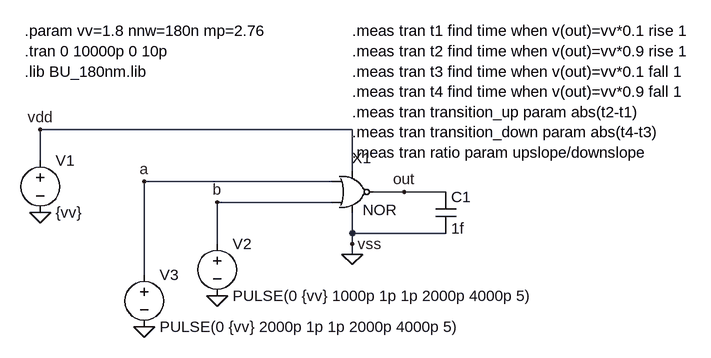
[diagram p0: schematic nor_test.asc]
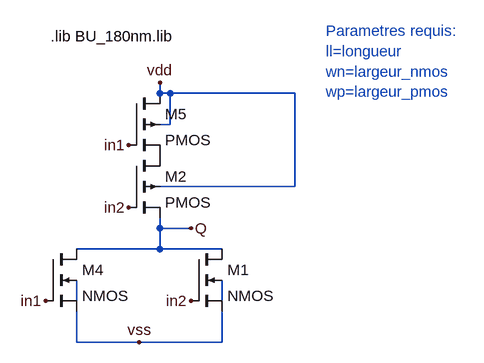
[diagram p1: sub-circuit nor.asc]
nor_test.asc, the LTspice schematic file:
Version 4
SHEET 1 1168 680
WIRE 416 224 -64 224
WIRE -64 272 -64 224
WIRE 416 288 416 224
WIRE 384 304 96 304
WIRE 496 320 448 320
WIRE 560 320 496 320
WIRE 384 336 208 336
WIRE 416 384 416 352
WIRE 560 384 416 384
WIRE 208 400 208 336
WIRE 416 400 416 384
WIRE 416 416 416 400
WIRE 96 448 96 304
FLAG -64 352 0
FLAG 208 480 0
FLAG 416 416 0
FLAG -64 224 vdd
FLAG 416 400 vss
FLAG 208 336 b
FLAG 496 320 out
FLAG 96 528 0
FLAG 96 304 a
SYMBOL /voltage -64 256 R0
SYMATTR InstName V1
SYMATTR Value {vv}
SYMBOL /voltage 208 384 R0
SYMATTR InstName V2
SYMATTR Value PULSE(0 {vv} 1000p 1p 1p 2000p 4000p 5)
SYMBOL /voltage 96 432 R0
SYMATTR InstName V3
SYMATTR Value PULSE(0 {vv} 2000p 1p 1p 2000p 4000p 5)
SYMBOL nor 416 320 R0
SYMATTR InstName X1
SYMATTR SpiceLine ll=180n wn={nnw} wp={nnw*mp}
SYMBOL cap 544 320 R0
SYMATTR InstName C1
SYMATTR Value 1f
TEXT -88 72 Left 2 !.param vv=1.8 nnw=180n mp=2.76\n.tran 0 10000p 0 10p\n.lib BU_180nm.lib
TEXT 416 72 Left 2 !.meas tran t1 find time when v(out)=vv*0.1 rise 1\n.meas tran t2 find time when v(out)=vv*0.9 rise 1\n.meas tran t3 find time when v(out)=vv*0.1 fall 1\n.meas tran t4 find time when v(out)=vv*0.9 fall 1\n.meas tran transition_up param abs(t2-t1)\n.meas tran transition_down param abs(t4-t3)\n.meas tran ratio param upslope/downslope

nor.asc, the sub-circuit schematic file:
Version 4
SHEET 1 1252 1108
WIRE 320 288 320 272
WIRE 336 288 320 288
WIRE 528 288 336 288
WIRE 336 336 336 288
WIRE 336 336 320 336
WIRE 528 432 528 288
WIRE 528 432 320 432
WIRE 320 496 320 480
WIRE 368 496 320 496
WIRE 320 528 320 496
WIRE 320 528 192 528
WIRE 416 528 320 528
WIRE 192 608 192 576
WIRE 416 608 416 576
WIRE 192 672 192 624
WIRE 288 672 192 672
WIRE 416 672 416 624
WIRE 416 672 288 672
FLAG 320 272 vdd
FLAG 288 672 vss
FLAG 144 608 in1
FLAG 368 608 in2
FLAG 272 464 in2
FLAG 272 368 in1
FLAG 368 496 Q
SYMBOL nmos4 368 528 R0
SYMATTR InstName M1
SYMATTR Value2 l={ll} w={wn} ad={450n*{wn}} as={450n*{wn}} pd={900n+{wn}} ps={1080n+{wn}}
SYMBOL nmos4 144 528 R0
SYMATTR InstName M4
SYMATTR Value2 l={ll} w={2*wn} ad={450n*{wn}} as={450n*{wn}} pd={900n+{wn}} ps={1080n+{wn}}
SYMBOL pmos4 272 288 R0
SYMATTR InstName M5
SYMATTR Value2 l={ll} w={2*wp} ad={450n*{wp}} as={450n*{wp}} pd={900n+{wp}} ps={1080n+{wp}}
SYMBOL pmos4 272 384 R0
SYMATTR InstName M2
SYMATTR Value2 l={ll} w={2*wp} ad={450n*{wp}} as={450n*{wp}} pd={900n+{wp}} ps={1080n+{wp}}
TEXT 152 200 Left 2 !.lib BU_180nm.lib
TEXT 576 192 Left 2 ;Parametres requis: \nll=longueur \nwn=largeur_nmos \nwp=largeur_pmos

The netlist it stands for:
* nor_test.asc
V1 vdd 0 {vv}
V2 b 0 PULSE(0 {vv} 1000p 1p 1p 2000p 4000p 5)
V3 a 0 PULSE(0 {vv} 2000p 1p 1p 2000p 4000p 5)
XX1 a out vdd 0 b nor params: NOR ll=180n wn={nnw} wp={nnw*mp}
C1 out 0 1f

* block symbol definitions
.subckt nor in1 Q vdd vss in2
M1 Q in2 vss N002 NMOS l={ll} w={wn} ad={450n*{wn}} as={450n*{wn}} pd={900n+{wn}} ps={1080n+{wn}}
M4 Q in1 vss N001 NMOS l={ll} w={2*wn} ad={450n*{wn}} as={450n*{wn}} pd={900n+{wn}} ps={1080n+{wn}}
M5 vdd in1 P001 vdd PMOS l={ll} w={2*wp} ad={450n*{wp}} as={450n*{wp}} pd={900n+{wp}} ps={1080n+{wp}}
M2 P001 in2 Q vdd PMOS l={ll} w={2*wp} ad={450n*{wp}} as={450n*{wp}} pd={900n+{wp}} ps={1080n+{wp}}
.lib BU_180nm.lib
* Parametres requis:
* ll=longueur
* wn=largeur_nmos
* wp=largeur_pmos
.ends nor

.model NMOS NMOS
.model PMOS PMOS
.lib standard.mos
.param vv=1.8 nnw=180n mp=2.76
.tran 0 10000p 0 10p
.lib BU_180nm.lib
.meas tran t1 find time when v(out)=vv*0.1 rise 1
.meas tran t2 find time when v(out)=vv*0.9 rise 1
.meas tran t3 find time when v(out)=vv*0.1 fall 1
.meas tran t4 find time when v(out)=vv*0.9 fall 1
.meas tran transition_up param abs(t2-t1)
.meas tran transition_down param abs(t4-t3)
.meas tran ratio param upslope/downslope
.backanno
.end

* Results of the author's LTspice run, read from the files saved beside the schematic
* Operating Point, zero values left out:
*   V(vdd) = 1.8 V
*   V(out) = 1.8 V
*   I(V1) = -2.39 nA
*   Ix(x1:VDD) = 2.39 nA
*   Ix(x1:VSS) = -2.39 nA
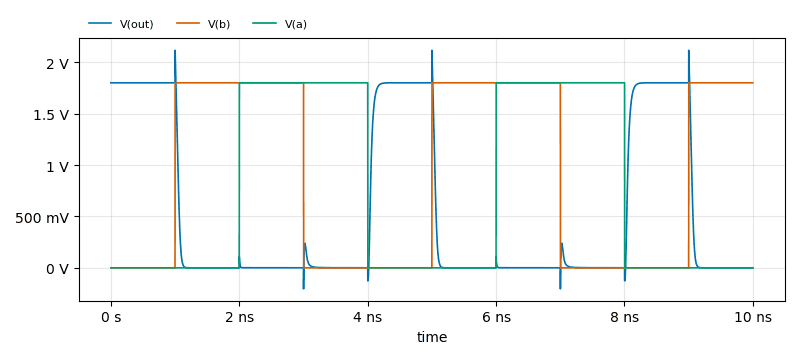
[diagram p2: Transient Analysis of nor_test.asc, plotted from the saved traces]
* Transient Analysis, 1 run:
*   V(out): min -204.1 mV, max 2.116 V, average 550.5 mV, rms 980.8 mV, last 3.206 µV
*   V(b): min 0 V, max 1.8 V, average 900.3 mV, rms 1.273 V, last 1.8 V
*   V(a): min 0 V, max 1.8 V, average 720.4 mV, rms 1.139 V, last 0 V
* From the log:
*   t1: time=3.01251e-009 at 3.01251e-009
*   t2: time=4.10582e-009 at 4.10582e-009
*   t3: time=1.09013e-009 at 1.09013e-009
*   t4: time=1.02088e-009 at 1.02088e-009
*   transition_up: abs(t2-t1)=1.09332e-009
*   transition_down: abs(t4-t3)=6.92476e-011
*   Measurement "ratio" FAIL'ed